# EAGLE schematic SmartVision (EAGLE 7.3.0)

## Sheet 1 of 4
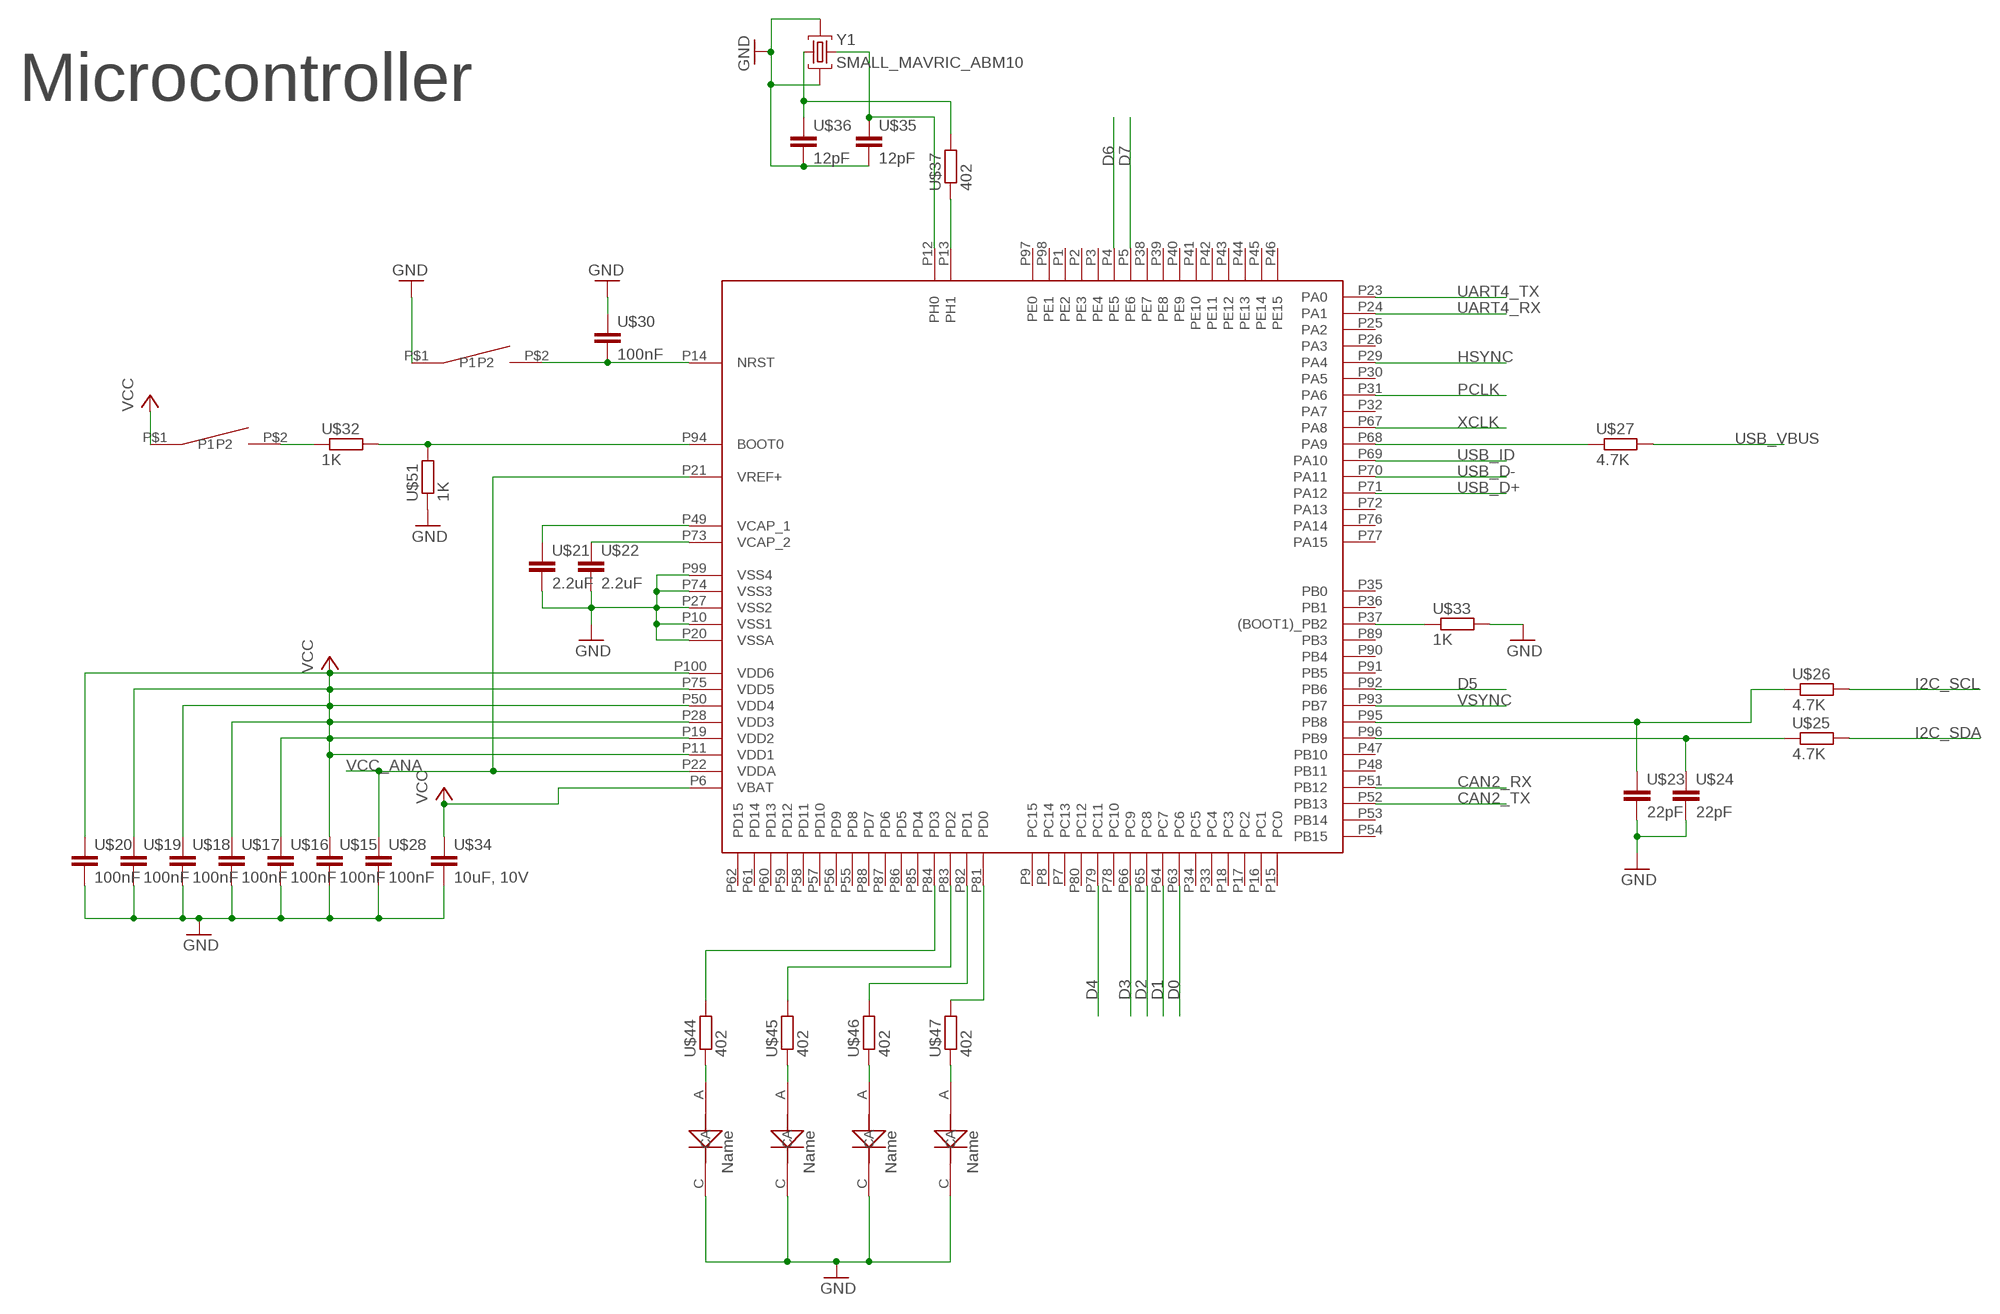
[diagram p0: schematic, sheet 1]

### Parts
U$1  STM32F407VGT6-100  [STM32F407VGT6-100]
U$15  100nF  SMALL_MAVRIC_CAPACITOR_C0402  [SMALL_MAVRIC_SMALL_MAVRIC_CAPACITOR_C0402]
U$16  100nF  SMALL_MAVRIC_CAPACITOR_C0402  [SMALL_MAVRIC_SMALL_MAVRIC_CAPACITOR_C0402]
U$17  100nF  SMALL_MAVRIC_CAPACITOR_C0402  [SMALL_MAVRIC_SMALL_MAVRIC_CAPACITOR_C0402]
U$18  100nF  SMALL_MAVRIC_CAPACITOR_C0402  [SMALL_MAVRIC_SMALL_MAVRIC_CAPACITOR_C0402]
U$19  100nF  SMALL_MAVRIC_CAPACITOR_C0402  [SMALL_MAVRIC_SMALL_MAVRIC_CAPACITOR_C0402]
U$20  100nF  SMALL_MAVRIC_CAPACITOR_C0402  [SMALL_MAVRIC_SMALL_MAVRIC_CAPACITOR_C0402]
U$21  2.2uF  SMALL_MAVRIC_CAPACITOR_C0402  [SMALL_MAVRIC_SMALL_MAVRIC_CAPACITOR_C0402]
U$22  2.2uF  SMALL_MAVRIC_CAPACITOR_C0402  [SMALL_MAVRIC_SMALL_MAVRIC_CAPACITOR_C0402]
U$23  22pF  SMALL_MAVRIC_CAPACITOR_C0402  [SMALL_MAVRIC_SMALL_MAVRIC_CAPACITOR_C0402]
U$24  22pF  SMALL_MAVRIC_CAPACITOR_C0402  [SMALL_MAVRIC_SMALL_MAVRIC_CAPACITOR_C0402]
U$25  4.7K  SMALL_MAVRIC_RESISTOR_R0402  [SMALL_MAVRIC_SMALL_MAVRIC_RESISTOR_R0402]
U$26  4.7K  SMALL_MAVRIC_RESISTOR_R0402  [SMALL_MAVRIC_SMALL_MAVRIC_RESISTOR_R0402]
U$27  4.7K  SMALL_MAVRIC_RESISTOR_R0402  [SMALL_MAVRIC_SMALL_MAVRIC_RESISTOR_R0402]
U$28  100nF  SMALL_MAVRIC_CAPACITOR_C0402  [SMALL_MAVRIC_SMALL_MAVRIC_CAPACITOR_C0402]
U$29  SWITCH_OFF_(ON)  [SWITCH_OFF_(ON)]
U$30  100nF  SMALL_MAVRIC_CAPACITOR_C0402  [SMALL_MAVRIC_SMALL_MAVRIC_CAPACITOR_C0402]
U$31  SWITCH_OFF_(ON)  [SWITCH_OFF_(ON)]
U$32  1K  SMALL_MAVRIC_RESISTOR_R0402  [SMALL_MAVRIC_SMALL_MAVRIC_RESISTOR_R0402]
U$33  1K  SMALL_MAVRIC_RESISTOR_R0402  [SMALL_MAVRIC_SMALL_MAVRIC_RESISTOR_R0402]
U$34  10uF, 10V  SMALL_MAVRIC_CAPACITOR_C0603  [SMALL_MAVRIC_SMALL_MAVRIC_CAPACITOR_C0603]
U$35  12pF  SMALL_MAVRIC_CAPACITOR_C0402  [SMALL_MAVRIC_SMALL_MAVRIC_CAPACITOR_C0402]
U$36  12pF  SMALL_MAVRIC_CAPACITOR_C0402  [SMALL_MAVRIC_SMALL_MAVRIC_CAPACITOR_C0402]
U$37  402  SMALL_MAVRIC_RESISTOR_R0402  [SMALL_MAVRIC_SMALL_MAVRIC_RESISTOR_R0402]
U$40  LED  [LED]
U$41  LED  [LED]
U$42  LED  [LED]
U$43  LED  [LED]
U$44  402  SMALL_MAVRIC_RESISTOR_R0402  [SMALL_MAVRIC_SMALL_MAVRIC_RESISTOR_R0402]
U$45  402  SMALL_MAVRIC_RESISTOR_R0402  [SMALL_MAVRIC_SMALL_MAVRIC_RESISTOR_R0402]
U$46  402  SMALL_MAVRIC_RESISTOR_R0402  [SMALL_MAVRIC_SMALL_MAVRIC_RESISTOR_R0402]
U$47  402  SMALL_MAVRIC_RESISTOR_R0402  [SMALL_MAVRIC_SMALL_MAVRIC_RESISTOR_R0402]
U$51  1K  SMALL_MAVRIC_RESISTOR_R0402  [SMALL_MAVRIC_SMALL_MAVRIC_RESISTOR_R0402]
Y1  SMALL_MAVRIC_ABM10  [SMALL_MAVRIC_OSCILLATOR_ABM10]

### Nets
CAN2_RX: U$1.P51(PB12) ; also sheet 3
CAN2_TX: U$1.P52(PB13) ; also sheet 3
D0: U$1.P63(PC6) ; also sheet 3
D1: U$1.P64(PC7) ; also sheet 3
D2: U$1.P65(PC8) ; also sheet 3
D3: U$1.P66(PC9) ; also sheet 3
D4: U$1.P79(PC11) ; also sheet 3
D5: U$1.P92(PB6) ; also sheet 3
D6: U$1.P4(PE5) ; also sheet 3
D7: U$1.P5(PE6) ; also sheet 3
GND: U$1.P10(VSS1) U$1.P20(VSSA) U$1.P27(VSS2) U$1.P74(VSS3) U$1.P99(VSS4) U$15.2 U$16.2 U$17.2 U$18.2 U$19.2 U$20.2 U$21.2 U$22.2 U$23.2 U$24.2 U$28.2 U$29.P$1(P1) U$30.1 U$33.2 U$34.2 U$35.2 U$36.2 U$40.C U$41.C U$42.C U$43.C U$51.1 Y1.2 Y1.4 ; also sheet 2,3,4
HSYNC: U$1.P29(PA4) ; also sheet 3
I2C_SCL: U$26.2 ; also sheet 3,4
I2C_SDA: U$25.2 ; also sheet 3,4
N$4: U$1.P81(PD0) U$47.2
N$5: U$1.P82(PD1) U$46.2
N$6: U$1.P83(PD2) U$45.2
N$7: U$1.P84(PD3) U$44.2
N$8: U$1.P12(PH0) U$35.1 Y1.3
N$9: U$40.A U$44.1
N$10: U$36.1 U$37.2 Y1.1
N$11: U$41.A U$45.1
N$12: U$42.A U$46.1
N$13: U$1.P13(PH1) U$37.1
N$14: U$1.P96(PB9) U$24.1 U$25.1
N$15: U$1.P49(VCAP_1) U$21.1
N$16: U$1.P73(VCAP_2) U$22.1
N$17: U$1.P95(PB8) U$23.1 U$26.1
N$18: U$1.P68(PA9) U$27.1
N$19: U$1.P14(NRST) U$29.P$2(P2) U$30.2
N$20: U$31.P$2(P2) U$32.1
N$21: U$1.P94(BOOT0) U$32.2 U$51.2
N$22: U$1.P37((BOOT1)_PB2) U$33.1
N$23: U$43.A U$47.1
PCLK: U$1.P31(PA6) ; also sheet 3
UART4_RX: U$1.P24(PA1) ; also sheet 3
UART4_TX: U$1.P23(PA0) ; also sheet 3
USB_D+: U$1.P71(PA12) ; also sheet 3
USB_D-: U$1.P70(PA11) ; also sheet 3
USB_ID: U$1.P69(PA10) ; also sheet 3
USB_VBUS: U$27.2 ; also sheet 2,3
VCC: U$1.P6(VBAT) U$1.P11(VDD1) U$1.P19(VDD2) U$1.P28(VDD3) U$1.P50(VDD4) U$1.P75(VDD5) U$1.P100(VDD6) U$15.1 U$16.1 U$17.1 U$18.1 U$19.1 U$20.1 U$31.P$1(P1) U$34.1 ; also sheet 2,3,4
VCC_ANA: U$1.P21(VREF+) U$1.P22(VDDA) U$28.1 ; also sheet 2,3,4
VSYNC: U$1.P93(PB7) ; also sheet 3
XCLK: U$1.P67(PA8) ; also sheet 3
Unconnected: U$1.P1(PE2) U$1.P2(PE3) U$1.P3(PE4) U$1.P7(PC13) U$1.P8(PC14) U$1.P9(PC15) U$1.P15(PC0) U$1.P16(PC1) U$1.P17(PC2) U$1.P18(PC3) U$1.P25(PA2) U$1.P26(PA3) U$1.P30(PA5) U$1.P32(PA7) U$1.P33(PC4) U$1.P34(PC5) U$1.P35(PB0) U$1.P36(PB1) U$1.P38(PE7) U$1.P39(PE8) U$1.P40(PE9) U$1.P41(PE10) U$1.P42(PE11) U$1.P43(PE12) U$1.P44(PE13) U$1.P45(PE14) U$1.P46(PE15) U$1.P47(PB10) U$1.P48(PB11) U$1.P53(PB14) U$1.P54(PB15) U$1.P55(PD8) U$1.P56(PD9) U$1.P57(PD10) U$1.P58(PD11) U$1.P59(PD12) U$1.P60(PD13) U$1.P61(PD14) U$1.P62(PD15) U$1.P72(PA13) U$1.P76(PA14) U$1.P77(PA15) U$1.P78(PC10) U$1.P80(PC12) U$1.P85(PD4) U$1.P86(PD5) U$1.P87(PD6) U$1.P88(PD7) U$1.P89(PB3) U$1.P90(PB4) U$1.P91(PB5) U$1.P97(PE0) U$1.P98(PE1)

### Notes on the sheet
- Microcontroller

## Sheet 2 of 4
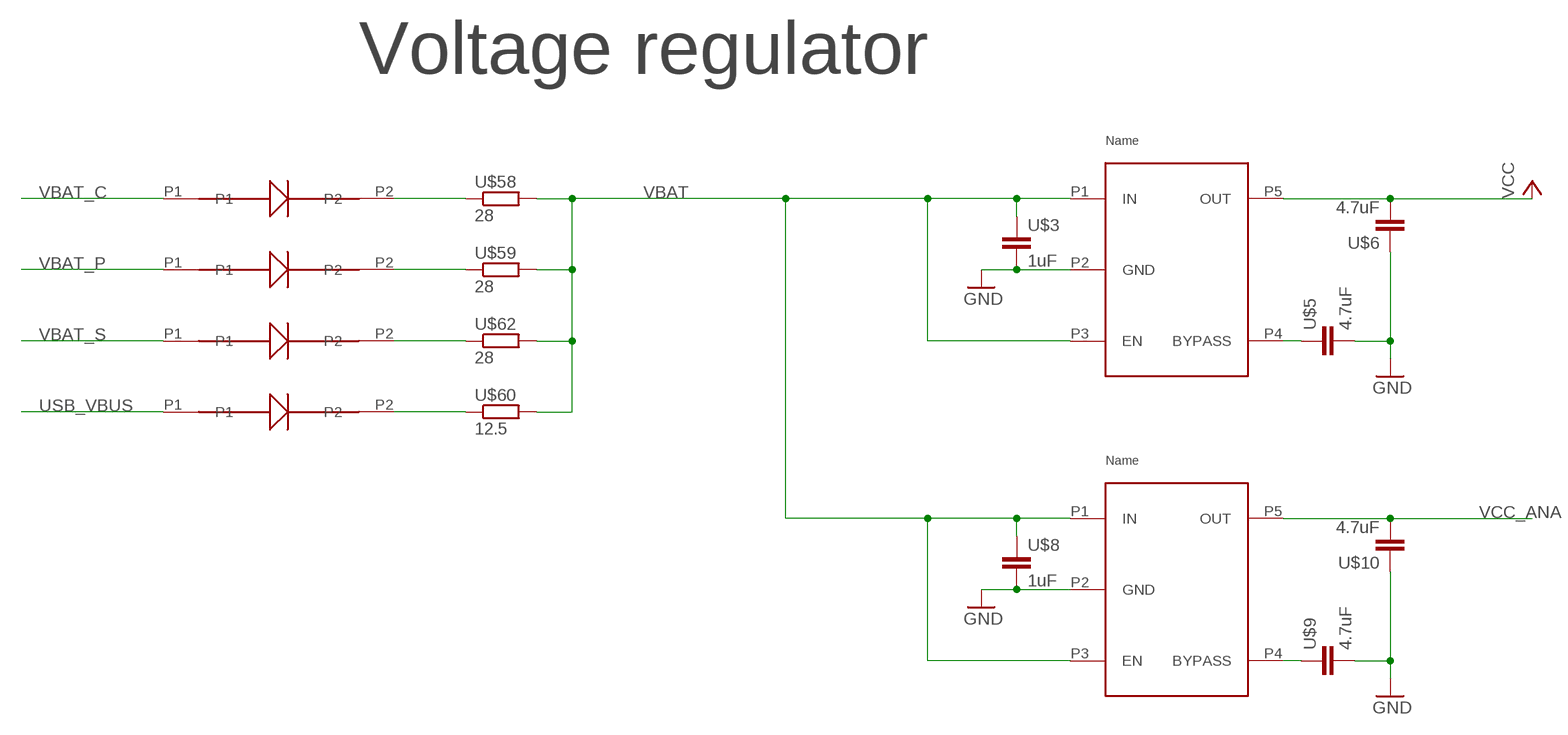
[diagram p1: schematic, sheet 2]

### Parts
U$2  VOLTAGE_REGULATOR_3V  [VOLTAGE_REGULATOR_3V]
U$3  1uF  SMALL_MAVRIC_CAPACITOR_C0402  [SMALL_MAVRIC_SMALL_MAVRIC_CAPACITOR_C0402]
U$5  4.7uF  SMALL_MAVRIC_CAPACITOR_C0603  [SMALL_MAVRIC_SMALL_MAVRIC_CAPACITOR_C0603]
U$6  4.7uF  SMALL_MAVRIC_CAPACITOR_C0603  [SMALL_MAVRIC_SMALL_MAVRIC_CAPACITOR_C0603]
U$7  VOLTAGE_REGULATOR_3V  [VOLTAGE_REGULATOR_3V]
U$8  1uF  SMALL_MAVRIC_CAPACITOR_C0402  [SMALL_MAVRIC_SMALL_MAVRIC_CAPACITOR_C0402]
U$9  4.7uF  SMALL_MAVRIC_CAPACITOR_C0603  [SMALL_MAVRIC_SMALL_MAVRIC_CAPACITOR_C0603]
U$10  4.7uF  SMALL_MAVRIC_CAPACITOR_C0603  [SMALL_MAVRIC_SMALL_MAVRIC_CAPACITOR_C0603]
U$55  DIODE_SCHOTTKY  [DIODE_SCHOTTKY]
U$56  DIODE_SCHOTTKY  [DIODE_SCHOTTKY]
U$57  DIODE_SCHOTTKY  [DIODE_SCHOTTKY]
U$58  28  SMALL_MAVRIC_RESISTOR_R0402  [SMALL_MAVRIC_SMALL_MAVRIC_RESISTOR_R0402]
U$59  28  SMALL_MAVRIC_RESISTOR_R0402  [SMALL_MAVRIC_SMALL_MAVRIC_RESISTOR_R0402]
U$60  12.5  SMALL_MAVRIC_RESISTOR_R0402  [SMALL_MAVRIC_SMALL_MAVRIC_RESISTOR_R0402]
U$61  DIODE_SCHOTTKY  [DIODE_SCHOTTKY]
U$62  28  SMALL_MAVRIC_RESISTOR_R0402  [SMALL_MAVRIC_SMALL_MAVRIC_RESISTOR_R0402]

### Nets
GND: U$2.P2(GND) U$3.2 U$5.2 U$6.1 U$7.P2(GND) U$8.2 U$9.2 U$10.1 ; also sheet 1,3,4
N$1: U$7.P4(BYPASS) U$9.1
N$2: U$2.P4(BYPASS) U$5.1
N$24: U$61.P2 U$62.1
N$27: U$55.P2 U$58.1
N$28: U$56.P2 U$59.1
N$29: U$57.P2 U$60.1
USB_VBUS: U$57.P1 ; also sheet 1,3
VBAT: U$2.P1(IN) U$2.P3(EN) U$3.1 U$7.P1(IN) U$7.P3(EN) U$8.1 U$58.2 U$59.2 U$60.2 U$62.2
VBAT_C: U$55.P1 ; also sheet 3
VBAT_P: U$56.P1 ; also sheet 3
VBAT_S: U$61.P1 ; also sheet 3
VCC: U$2.P5(OUT) U$6.2 ; also sheet 1,3,4
VCC_ANA: U$7.P5(OUT) U$10.2 ; also sheet 1,3,4

### Notes on the sheet
- Voltage regulator

## Sheet 3 of 4
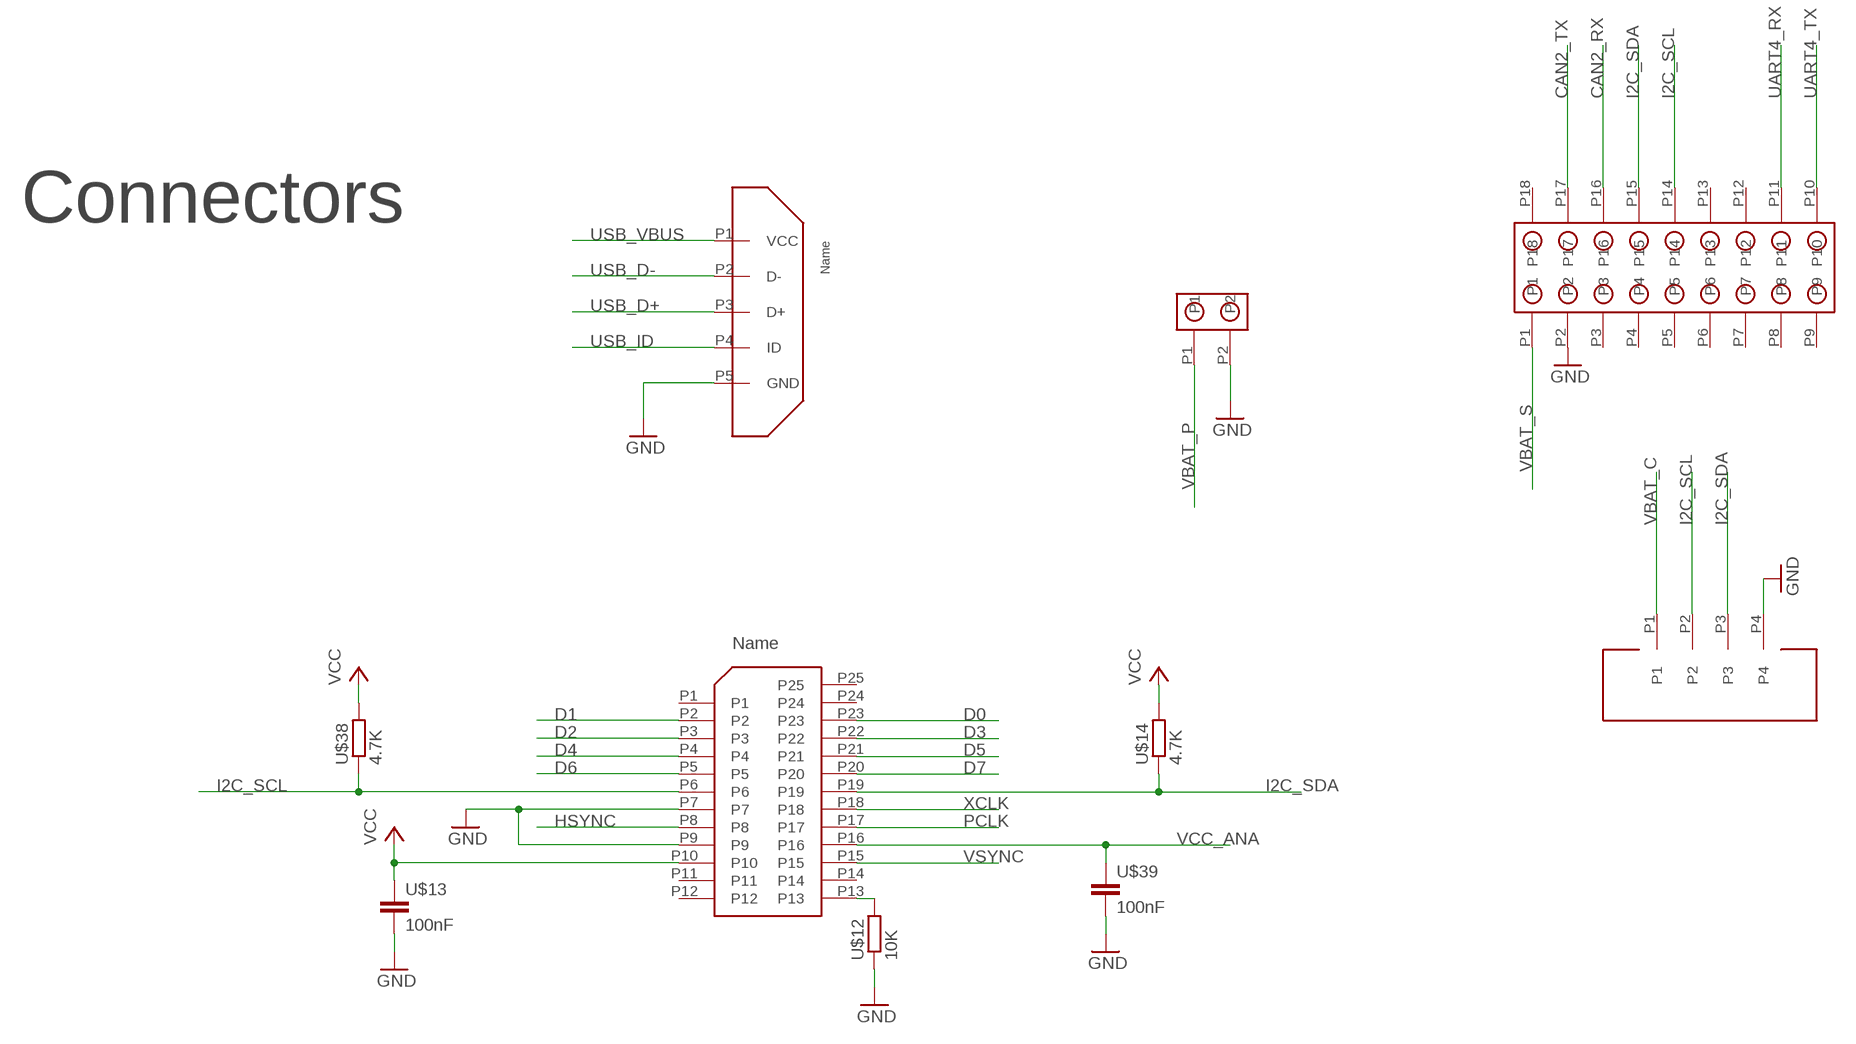
[diagram p2: schematic, sheet 3]

### Parts
U$4  MICRO_USB_PLUG  [MICRO_USB_PLUG]
U$11  CON_CAMERA_FPC_25P_0.3MM  [CON_CAMERA_FPC_25P_0.3MM]
U$12  10K  SMALL_MAVRIC_RESISTOR_R0402  [SMALL_MAVRIC_SMALL_MAVRIC_RESISTOR_R0402]
U$13  100nF  SMALL_MAVRIC_CAPACITOR_C0402  [SMALL_MAVRIC_SMALL_MAVRIC_CAPACITOR_C0402]
U$14  4.7K  SMALL_MAVRIC_RESISTOR_R0402  [SMALL_MAVRIC_SMALL_MAVRIC_RESISTOR_R0402]
U$38  4.7K  SMALL_MAVRIC_RESISTOR_R0402  [SMALL_MAVRIC_SMALL_MAVRIC_RESISTOR_R0402]
U$39  100nF  SMALL_MAVRIC_CAPACITOR_C0402  [SMALL_MAVRIC_SMALL_MAVRIC_CAPACITOR_C0402]
U$52  CON_2.54MM_18PINS_STACKABLE  [CON_2.54MM_18PINS_STACKABLE]
U$53  CON_1.25MM_4PINS  [CON_1.25MM_4PINS]
U$54  CON_2.54MM_2PINS_STACKABLE  [CON_2.54MM_2PINS_STACKABLE]

### Nets
CAN2_RX: U$52.P16 ; also sheet 1
CAN2_TX: U$52.P17 ; also sheet 1
D0: U$11.P23 ; also sheet 1
D1: U$11.P2 ; also sheet 1
D2: U$11.P3 ; also sheet 1
D3: U$11.P22 ; also sheet 1
D4: U$11.P4 ; also sheet 1
D5: U$11.P21 ; also sheet 1
D6: U$11.P5 ; also sheet 1
D7: U$11.P20 ; also sheet 1
GND: U$4.P5(GND) U$11.P7 U$11.P9 U$12.1 U$13.2 U$39.2 U$52.P2 U$53.P4 U$54.P2 ; also sheet 1,2,4
HSYNC: U$11.P8 ; also sheet 1
I2C_SCL: U$11.P6 U$38.1 U$52.P14 U$53.P2 ; also sheet 1,4
I2C_SDA: U$11.P19 U$14.1 U$52.P15 U$53.P3 ; also sheet 1,4
N$3: U$11.P13 U$12.2
PCLK: U$11.P17 ; also sheet 1
UART4_RX: U$52.P11 ; also sheet 1
UART4_TX: U$52.P10 ; also sheet 1
USB_D+: U$4.P3(D+) ; also sheet 1
USB_D-: U$4.P2(D-) ; also sheet 1
USB_ID: U$4.P4(ID) ; also sheet 1
USB_VBUS: U$4.P1(VCC) ; also sheet 1,2
VBAT_C: U$53.P1 ; also sheet 2
VBAT_P: U$54.P1 ; also sheet 2
VBAT_S: U$52.P1 ; also sheet 2
VCC: U$11.P10 U$13.1 U$14.2 U$38.2 ; also sheet 1,2,4
VCC_ANA: U$11.P16 U$39.1 ; also sheet 1,2,4
VSYNC: U$11.P15 ; also sheet 1
XCLK: U$11.P18 ; also sheet 1
Unconnected: U$11.P1 U$11.P11 U$11.P12 U$11.P14 U$11.P24 U$11.P25 U$52.P3 U$52.P4 U$52.P5 U$52.P6 U$52.P7 U$52.P8 U$52.P9 U$52.P12 U$52.P13 U$52.P18

### Notes on the sheet
- Connectors

## Sheet 4 of 4
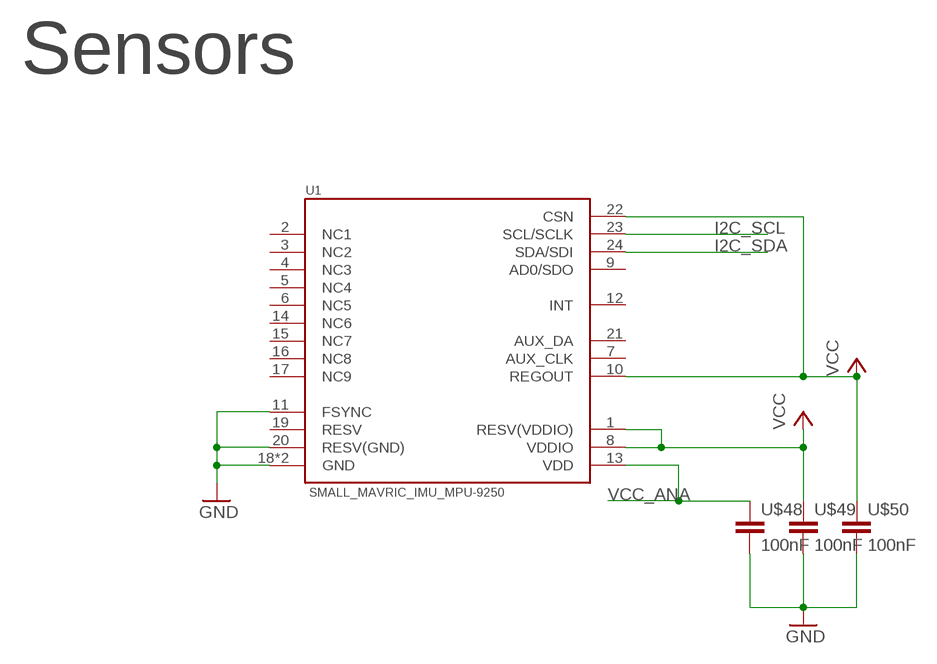
[diagram p3: schematic, sheet 4]

### Parts
U1  SMALL_MAVRIC_IMU_MPU-9250  [SMALL_MAVRIC_SMALL_MAVRIC_QFN-24_3.0X3.0MM]
U$48  100nF  SMALL_MAVRIC_CAPACITOR_C0402  [SMALL_MAVRIC_SMALL_MAVRIC_CAPACITOR_C0402]
U$49  100nF  SMALL_MAVRIC_CAPACITOR_C0402  [SMALL_MAVRIC_SMALL_MAVRIC_CAPACITOR_C0402]
U$50  100nF  SMALL_MAVRIC_CAPACITOR_C0402  [SMALL_MAVRIC_SMALL_MAVRIC_CAPACITOR_C0402]

### Nets
GND: U1.11(FSYNC) U1.18(GND) U1.20(RESV(GND)) U1.CENTRAL_PAD(GND) U$48.2 U$49.2 U$50.2 ; also sheet 1,2,3
I2C_SCL: U1.23(SCL/SCLK) ; also sheet 1,3
I2C_SDA: U1.24(SDA/SDI) ; also sheet 1,3
VCC: U1.1(RESV(VDDIO)) U1.8(VDDIO) U1.10(REGOUT) U1.22(CSN) U$49.1 U$50.1 ; also sheet 1,2,3
VCC_ANA: U1.13(VDD) U$48.1 ; also sheet 1,2,3
Unconnected: U1.2(NC1) U1.3(NC2) U1.4(NC3) U1.5(NC4) U1.6(NC5) U1.7(AUX_CLK) U1.9(AD0/SDO) U1.12(INT) U1.14(NC6) U1.15(NC7) U1.16(NC8) U1.17(NC9) U1.19(RESV) U1.21(AUX_DA)

### Notes on the sheet
- Sensors

## Library data of the parts
U1 = small_mavric:SMALL_MAVRIC_IMU_MPU-9250; DISTRIBUTOR: digikey; ORDER_CODE: 1428-1019-1-ND; PLACE_PART: YES
U$1 = STM32F4:STM32F407VGT6-100: Stm32F407VGT6 microcontroler with LQFP100 footprint (100 pins)
U$2 U$7 = STM32F4:VOLTAGE_REGULATOR_3V
U$3 U$5 U$6 U$8-U$10 U$13 U$15-U$24 U$28 U$30 U$34-U$36 U$39 U$48-U$50 = small_mavric:SMALL_MAVRIC_CAPACITOR_; PLACE_PART: YES
U$4 = STM32F4:MICRO_USB_PLUG
U$11 = STM32F4:CON_CAMERA_FPC_25P_0.3MM
U$12 U$14 U$25-U$27 U$32 U$33 U$37 U$38 U$44-U$47 U$51 U$58-U$60 U$62 = small_mavric:SMALL_MAVRIC_RESISTOR_; PLACE_PART: YES
U$29 U$31 = STM32F4:SWITCH_OFF_(ON)
U$40-U$43 = STM32F4:LED
U$52 = STM32F4:CON_2.54MM_18PINS_STACKABLE
U$53 = STM32F4:CON_1.25MM_4PINS
U$54 = STM32F4:CON_2.54MM_2PINS_STACKABLE
U$55-U$57 U$61 = STM32F4:DIODE_SCHOTTKY
Y1 = small_mavric:SMALL_MAVRIC_ABM10; DISTRIBUTOR: mouser; MF_NUM: 815-ABM10-25-E20-T